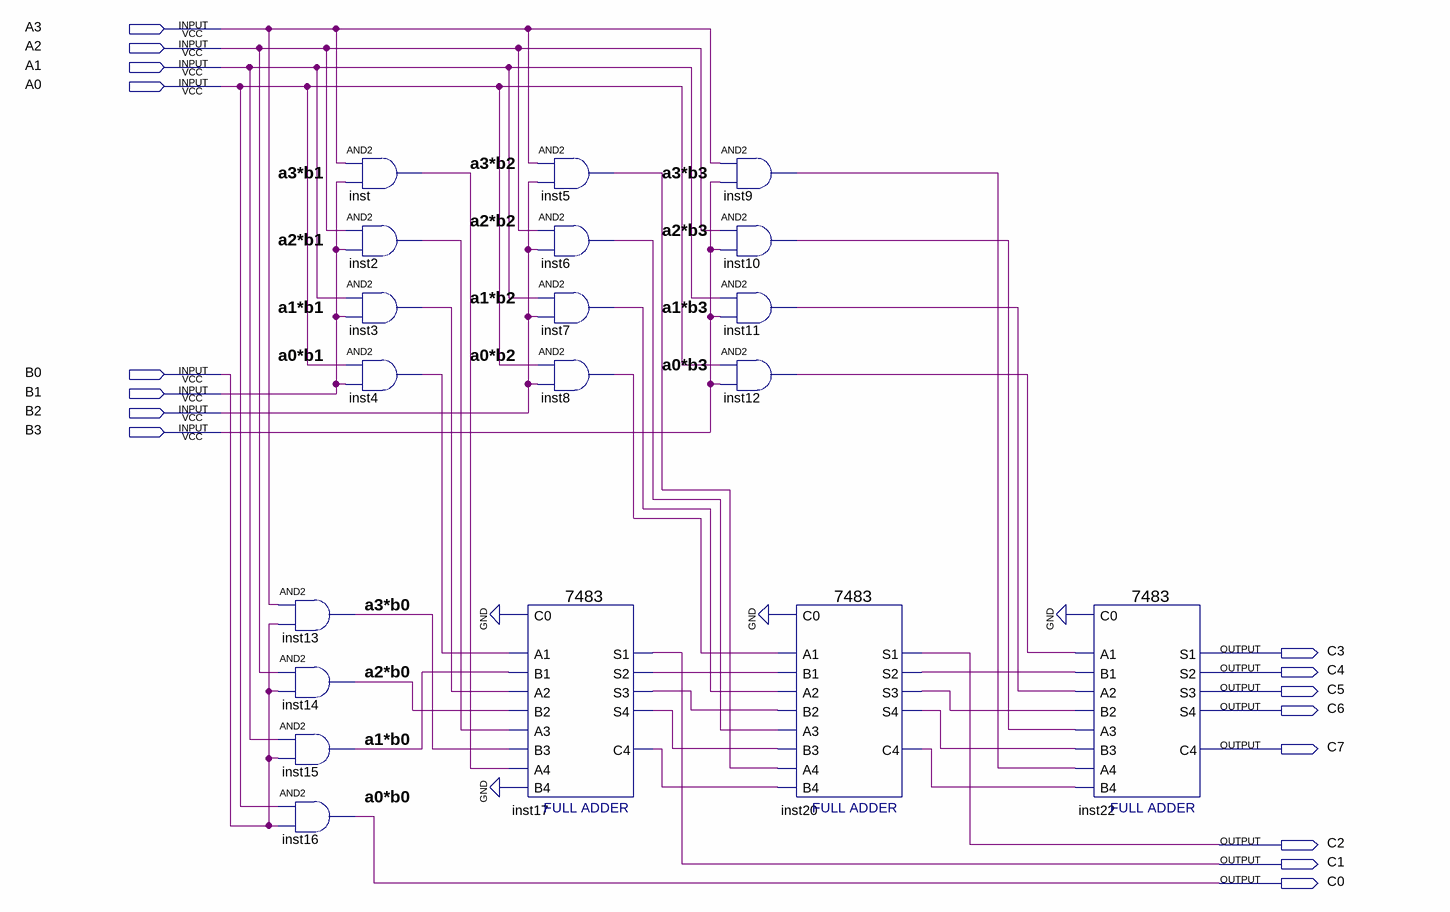
[diagram p0: schematic sheet]
// Quartus schematic p_7.bdf as structural Verilog: 19 symbols, 16 pins
module p_7 (
  input  A3,
  input  A2,
  input  A1,
  input  A0,
  input  B0,
  input  B1,
  input  B2,
  input  B3,
  output C3,
  output C4,
  output C5,
  output C6,
  output C7,
  output C2,
  output C1,
  output C0
);

  wire inst2_out, inst3_out, inst4_out, inst5_out, inst6_out, inst7_out, inst8_out, inst9_out, inst10_out,
       inst11_out, inst12_out, inst13_out, inst14_out, inst15_out, inst17_c4, inst17_s2, inst17_s3,
       inst17_s4, inst20_c4, inst20_s2, inst20_s3, inst20_s4, inst_out;

  and inst13 (inst13_out, A3, B0);
  and inst14 (inst14_out, A2, B0);
  and inst15 (inst15_out, A1, B0);
  and inst16 (C0, A0, B0);
  and inst (inst_out, A3, B1);
  and inst2 (inst2_out, A2, B1);
  and inst3 (inst3_out, A1, B1);
  and inst4 (inst4_out, A0, B1);
  and inst5 (inst5_out, A3, B2);
  and inst6 (inst6_out, A2, B2);
  and inst7 (inst7_out, A1, B2);
  and inst8 (inst8_out, A0, B2);
  \7483  inst17 (
    .B4(1'b0), .C0(1'b0), .A1(inst4_out), .A2(inst3_out), .B1(inst15_out), .B2(inst14_out), .A3(inst2_out),
    .B3(inst13_out), .A4(inst_out), .S3(inst17_s3), .S4(inst17_s4), .S2(inst17_s2), .C4(inst17_c4), .S1(C1));
  and inst9 (inst9_out, A3, B3);
  and inst10 (inst10_out, A2, B3);
  and inst11 (inst11_out, A1, B3);
  and inst12 (inst12_out, A0, B3);
  \7483  inst20 (
    .B4(inst17_c4), .C0(1'b0), .A1(inst8_out), .A2(inst7_out), .B1(inst17_s2), .B2(inst17_s3),
    .A3(inst6_out), .B3(inst17_s4), .A4(inst5_out), .S3(inst20_s3), .S4(inst20_s4), .S2(inst20_s2),
    .C4(inst20_c4), .S1(C2));
  \7483  inst22 (
    .B4(inst20_c4), .C0(1'b0), .A1(inst12_out), .A2(inst11_out), .B1(inst20_s2), .B2(inst20_s3),
    .A3(inst10_out), .B3(inst20_s4), .A4(inst9_out), .S3(C5), .S4(C6), .S2(C4), .C4(C7), .S1(C3));

  // Notes on the sheet:
  //   a3*b2
  //   a3*b1
  //   a3*b3
  //   a2*b2
  //   a2*b3
  //   a2*b1
  //   a1*b2
  //   a1*b1
  //   a1*b3
  //   a0*b1
  //   a0*b2
  //   a0*b3
  //   a3*b0
  //   a2*b0
  //   a1*b0
  //   a0*b0
endmodule
